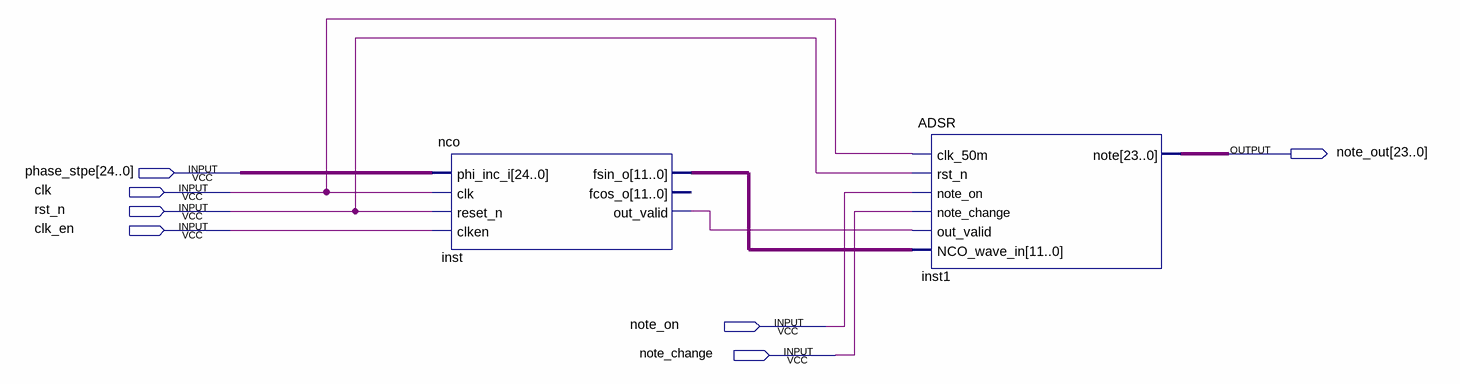
[diagram p0: schematic sheet]
// Quartus schematic ADSR_test.bdf as structural Verilog: 2 symbols, 7 pins
module ADSR_test (
  input  [24:0] phase_stpe,
  input  clk,
  input  rst_n,
  input  clk_en,
  input  note_on,
  input  note_change,
  output [23:0] note_out
);

  wire inst_out_valid;
  wire [11:0] inst_fsin_o;

  nco inst (
    .phi_inc_i(phase_stpe), .clk(clk), .reset_n(rst_n), .clken(clk_en), .fsin_o(inst_fsin_o),
    .out_valid(inst_out_valid));  // open: fcos_o
  ADSR inst1 (
    .clk_50m(clk), .rst_n(rst_n), .note_on(note_on), .note_change(note_change), .out_valid(inst_out_valid),
    .NCO_wave_in(inst_fsin_o), .note(note_out));
endmodule
